# EAGLE design opamp-tester-mk-1.0.0 (EAGLE 9.2.2)
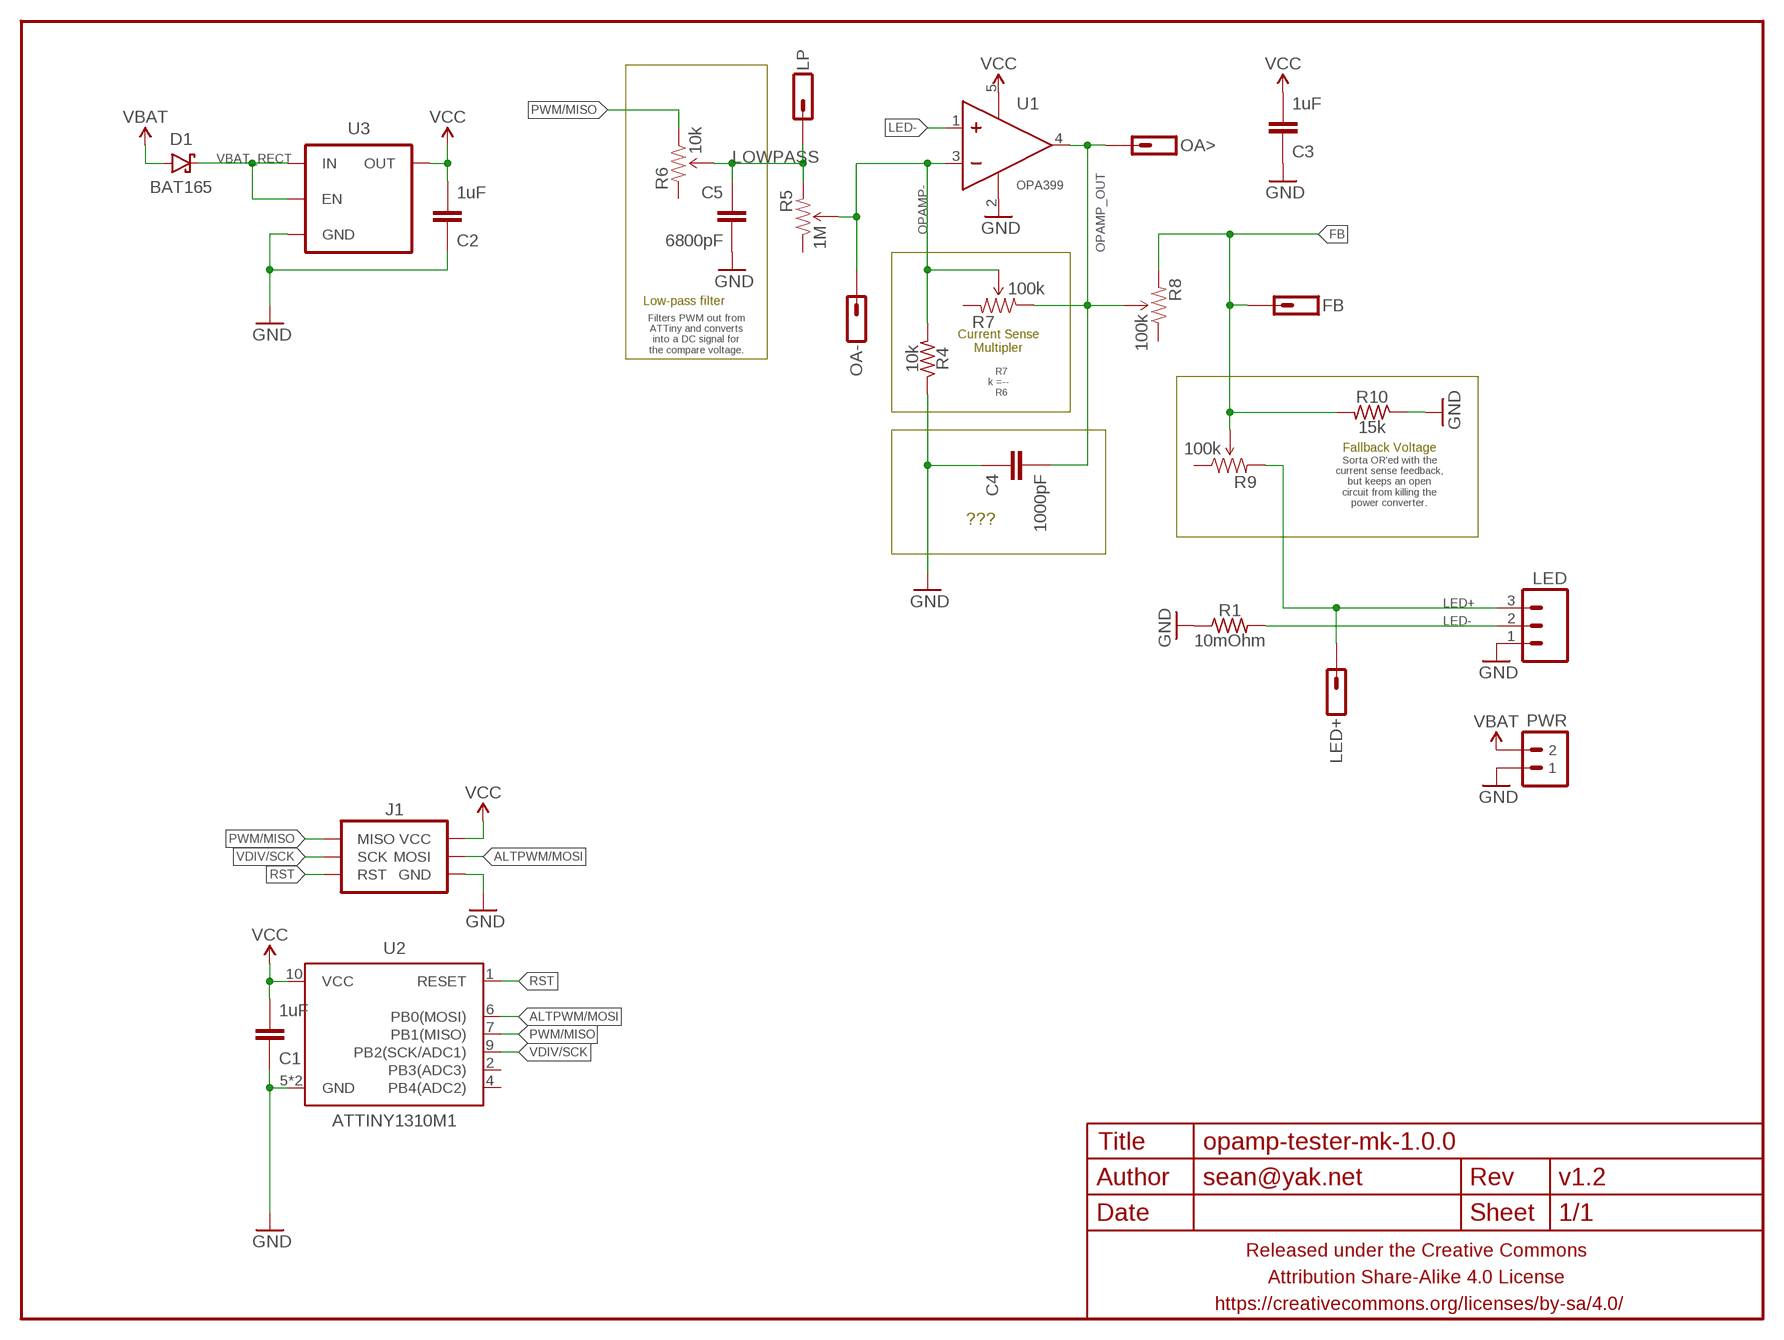
[diagram p0: schematic, sheet 1]

## Parts
C1  1uF  CAPACITOR-CERAMICC0402  [C0402]
C2  1uF  CAPACITOR-CERAMICC0402  [C0402]
C3  1uF  CAPACITOR-CERAMICC0402  [C0402]
C4  1000pF  CAPACITOR-CERAMICC0402  [C0402]
C5  6800pF  CAPACITOR-CERAMICC0402  [C0402]
D1  BAT165  DIODE-SCHOTTKYSOD323  [SOD323-SCHOTTKY]
FB  M01PTH-0.7MM-CIR  [1X01-0.7MM-CIR]
FRAME1  FRAME-LETTERNO_PACKAGE  [DUMMY]
J1  AVR_SPI_PRG_6SMD_TEST_POINTS  [2X3_SMD_TEST_POINTS]
LED  M03SCREW  [SCREWTERMINAL-3.5MM-3]
LED+  M01PTH-0.7MM-CIR  [1X01-0.7MM-CIR]
LP  M01PTH-0.7MM-CIR  [1X01-0.7MM-CIR]
OA-  M01PTH-0.7MM-CIR  [1X01-0.7MM-CIR]
OA>  M01PTH-0.7MM-CIR  [1X01-0.7MM-CIR]
PWR  M02PTH-2MM  [1X02-2MM-PTH]
R1  10mOhm  RESISTORR1206  [R1206]
R4  10k  RESISTORR0402  [R0402]
R5  1M  TRIMPOTEVM3Y-LESS  [EVM3Y-LESS]
R6  10k  TRIMPOTEVM3Y-LESS  [EVM3Y-LESS]
R7  100k  TRIMPOTEVM3Y-LESS  [EVM3Y-LESS]
R8  100k  TRIMPOTEVM3Y-LESS  [EVM3Y-LESS]
R9  100k  TRIMPOTEVM3Y-LESS  [EVM3Y-LESS]
R10  15k  RESISTORR0402  [R0402]
U1  OPA399  OPAMPOPA333-SC-70  [SC70]
U2  ATTINY1310M1  [QFN10(2X5)]
U3  V_REG_ENTLV700  [SC70]

## Nets
ALTPWM/MOSI: J1.4(MOSI) U2.6(PB0(MOSI))
FB: FB.P$1 R8.E(CW) R9.S(WIPER) R10.2
GND: C1.1 C2.1 C3.1 C4.1 C5.2 J1.6(GND) LED.1 PWR.P$1 R1.1 R4.1 R10.1 U1.2(V-) U2.5(GND) U2.PAD(GND) U3.2(GND)
LED+: LED+.P$1 LED.3 R9.E(CW)
LED-: LED.2 R1.2 U1.1(IN+)
LOWPASS: C5.1 LP.P$1 R5.E(CW) R6.S(WIPER)
OPAMP-: OA-.P$1 R4.2 R5.S(WIPER) R7.S(WIPER) U1.3(IN-)
OPAMP_OUT: C4.2 OA>.P$1 R7.A(CCW) R8.S(WIPER) U1.4(OUT)
PWM/MISO: J1.1(MISO) R6.A(CCW) U2.7(PB1(MISO))
RST: J1.5(RST) U2.1(RESET)
VBAT: D1.A PWR.P$2
VBAT_RECT: D1.C U3.1(IN) U3.3(EN)
VCC: C1.2 C2.2 C3.2 J1.2(VCC) U1.5(V+) U2.10(VCC) U3.5(OUT)
VDIV/SCK: J1.3(SCK) U2.9(PB2(SCK/ADC1))
Unconnected: R5.A(CCW) R6.E(CW) R7.E(CW) R8.A(CCW) R9.A(CCW) U2.2(PB3(ADC3)) U2.4(PB4(ADC2))

## Notes on the sheet
- Low-pass filter
- Filters PWM out from
  ATTiny and converts
  into a DC signal for
  the compare voltage.
- Current Sense
  Multipler
- R7
  k =--
    R6
- Fallback Voltage
- Sorta OR'ed with the
  current sense feedback,
  but keeps an open
  circuit from killing the
  power converter.
- ???

## Library data of the parts
C1-C5 = a_parts:CAPACITOR-CERAMIC: CAPACITOR, European symbol
D1 = a_parts:DIODE-SCHOTTKY: Schottky diodes in SFE's production catalog BAT20J 1A 23V 0.62Vf RB751 120mA 40V 0.37Vf PMEG4005EJ 0.5A 40V 0.42Vf MBRA140 1A 40V 0.5Vf B340A 3A 40V SMA
FB LED+ LP OA- OA> = a_parts:M01: Header 1 Standard 1-pin 0.1" header. Use with straight break away headers (SKU : PRT-00116), right angle break away headers (PRT-00553), swiss pins (PRT-00743), machine pins (PRT-00117), and female headers (PRT-00115).
FRAME1 = a_parts:FRAME-LETTER: Schematic Frame Standard 8.5x11 US Letter frame; DESIGNER: sean@yak.net; VERSION: v1.2
J1 = a_parts:AVR_SPI_PRG_6: AVR ISP 6 Pin This is the reduced ISP connector for AVR programming. Common on Arduino. This footprint will take up less PCB space and can be used with a 10-pin to 6-pin adapter such as SKU: BOB-08508 **Special note about "TEST_POINT" package. The stop mask is on the top side, so if you want your programming test points to be on the bottom of your board, make sure to place this package on the bottom side of the board. This also ensure that the orientation to program from the bottom side will be correct.
LED = a_parts:M03: Header 3 Standard 3-pin 0.1" header. Use with straight break away headers (SKU : PRT-00116), right angle break away headers (PRT-00553), swiss pins (PRT-00743), machine pins (PRT-00117), and female headers (PRT-00115). Molex polarized connector foot print use with SKU : PRT-08232 with associated crimp pins and housings.
PWR = a_parts:M02: Standard 2-pin 0.1" header. Use with - straight break away headers ( PRT-00116) - right angle break away headers (PRT-00553) - swiss pins (PRT-00743) - machine pins (PRT-00117) - female headers (PRT-00115) Molex polarized connector foot print use with: PRT-08233 with associated crimp pins and housings. 2.54_SCREWTERM for use with PRT-10571. 3.5mm Screw Terminal footprints for PRT-08084 5mm Screw Terminal footprints for use with PRT-08433
R1 R4 R10 = a_parts:RESISTOR: RESISTOR, American symbol
R5-R9 = a_parts:TRIMPOT: Various small potentiometers for "set-and-forget" applications
U1 = a_parts:OPAMP
U2 = a_parts:ATTINY13: Atmel 8-pin 1kB flash uC
U3 = a_parts:V_REG_EN

## Board
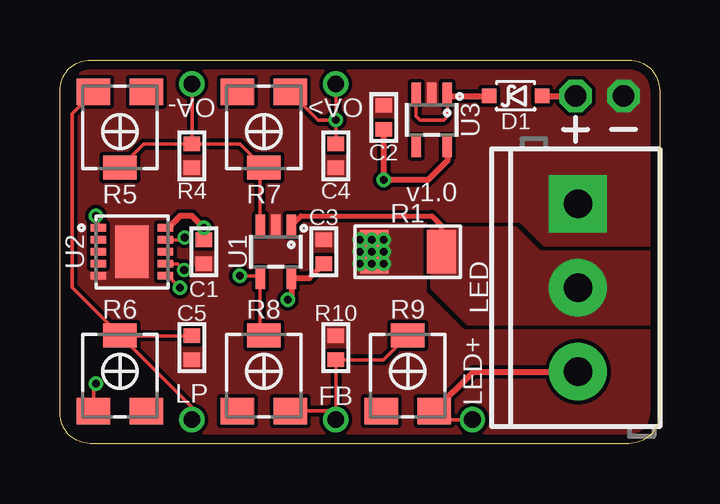
[diagram p1: board, top side]
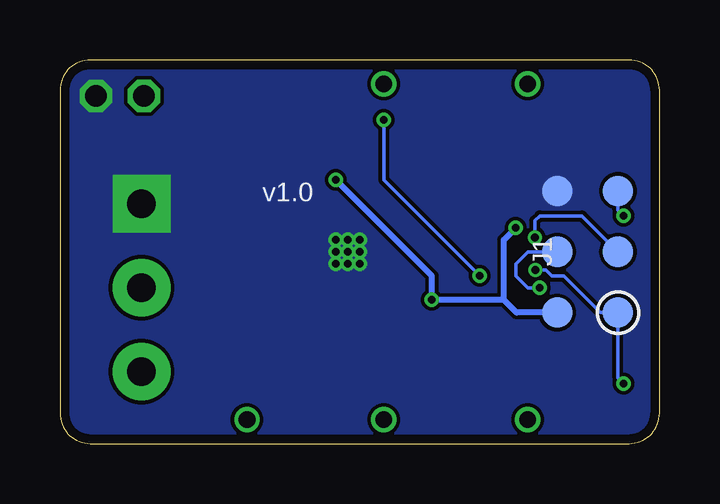
[diagram p2: board, bottom side, seen from below]

Size 25 x 16 mm. Coordinates in mm from the lower left corner, seen from the top.
Outline: 25,14.73 25,1.27 arc-90 23.73,0 1.27,0 arc-90 0,1.27 0,14.73 arc-90 1.27,16 23.73,16 arc-90 25,14.73
Copper layers (1*16): Top 0.035559375mm / dielectric 1.6mm / Bottom 0.035559375mm
Design rules "oshpark-2layer": minimum track width 6mil, minimum drill 10mil, track to track 6mil, track to pad 6mil, pad to pad 6mil, via to via 6mil, smd to smd 0mil, copper to edge 15mil, drill to drill 6mil, minimum pad ring 5mil, minimum via ring 5mil, stop-mask expansion 2.5mil, vias tented up to drill 20mil, thermal gap 10mil

### Footprints (pad centres in the part's own frame; a part is rotated, then mirrored left to right if it is on the bottom)
C0402 = smd 0.6 x 0.7: 1 -0.5,0; 2 0.5,0
SOD323-SCHOTTKY = smd 0.6 x 0.6: A -1.1,0; C 1.1,0
1X01-0.7MM-CIR = drill 0.7: P$1 0,0
2X3_SMD_TEST_POINTS = smd 1.27 x 1.27: 1 -2.54,-1.27; 2 -2.54,1.27; 3 0,-1.27; 4 0,1.27; 5 2.54,-1.27; 6 2.54,1.27
SCREWTERMINAL-3.5MM-3 = drill 1.2 pad 2.413 square: 1 0,0 | drill 1.2 pad 2.413: 2 3.5,0; 3 7,0
1X02-2MM-PTH = drill 0.9 octagon: P$1 -1,0; P$2 1,0
R1206 = smd 1.2 x 1.8: 1 -1.4,0; 2 1.4,0
R0402 = smd 0.6 x 0.7: 1 -0.5,0; 2 0.5,0
EVM3Y-LESS = smd 1.4 x 1.1: A -1.1,-1.65; E 1.1,-1.65 | smd 1.4 x 1: S 0,1.5
SC70 = smd 0.4 x 0.9: 1 -0.65,-1.1; 2 0,-1.1; 3 0.65,-1.1; 4 0.65,1.1; 5 -0.65,1.1
QFN10(2X5) = smd 0.65 x 0.3: 1 -1.4,1; 2 -1.4,0.5; 3 -1.4,0; 4 -1.4,-0.5; 5 -1.4,-1; 6 1.4,-1; 7 1.4,-0.5; 8 1.4,0; 9 1.4,0.5; 10 1.4,1 | smd 1.4 x 2.2: PAD 0,0

### Placement (x,y rotation side)
C1  6,8 90 top
C2  13.5,13.6 270 top
C3  11,8 270 top
C4  11.5,12 90 top
C5  5.5,4 270 top
D1  19,14.5 180 top
FB  11.5,1 0 top
FRAME1  0,0 270 top
J1  3,8 90 bottom
LED  21.6,10 270 top
LED+  17.2,1 0 top
LP  5.5,1 0 top
OA-  5.5,15 0 top
OA>  11.5,15 0 top
PWR  22.5,14.5 180 top
R1  14.5,8 0 top
R4  5.5,12 90 top
R5  2.5,13.01 180 top
R6  2.5,3.01 0 top
R7  8.5,13.01 180 top
R8  8.5,3.01 0 top
R9  14.5,3.01 0 top
R10  11.5,4 270 top
U1  9,8 180 top
U2  3,8 0 top
U3  15.5,13.5 180 top

### Tracks (layer width: path | path; a pad name or v marks a point on that pad's centre or on a via)
ALTPWM/MOSI  (via drill 0.33)
  Top 0.152: U2.6 4.5,7 v5,6.5
  Bottom 0.152: J1.4 5.5,8 6,7.5 6,7 5.5,6.5 v5,6.5
FB
  Top 0.152: R8.E 11.14,1.36 FB.P$1 R10.2 13.49,3.5 R9.S
GND  (via drill 0.33)
  other vias: 13.5,8 13.5,8.5 13.5,7.5 13,7.5 13,8 13,8.5 12.5,7.5 12.5,8 12.5,8.5
  pour Top (rank 6, no thermals): 0,16 0,0 25,0 25,16
  pour Bottom (rank 6, no thermals): 0,0 0,16 25,16 25,0
LED+
  Top 0.152: LED+.P$1 15.96,1 R9.E
  Top 0.25: R9.E 17.24,3 LED.3
LED-
  Top 0.2: U1.1 10.05,9.5 15.5,9.5 15.9,9.1 R1.2
  pour Top (rank 4, no thermals): 15.5,9 19,9 20,8 25,8 25,5 17,5 15.5,6.5
LOWPASS
  Top 0.152: R6.S 0.5,6.51 0.5,13.76 R5.E | R6.S 5.5,1.51 LP.P$1 | C5.1 R6.S
OPAMP-
  Top 0.152: U1.3 8.35,11.36 R7.S 7.51,12.5 R4.2 | R5.S 3.49,12.5 R4.2 | OA-.P$1 R4.2
OPAMP_OUT  (via drill 0.33)
  Top 0.152: R8.S 8.35,4.66 U1.4 8.25,7 v7.5,7 | v11.5,13.5 C4.2 | OA>.P$1 v11.5,13.5 | R7.A 10.76,13.5 v11.5,13.5
  Bottom 0.152: v7.5,7 11.5,11 v11.5,13.5
PWM/MISO  (via drill 0.33)
  Top 0.152: U2.7 4.91,7.5 v5.17,7.24 | R6.A 1.4,2.4 v1.5,2.5
  Bottom 0.152: v5.17,7.24 4.74,7.24 4.5,7 4,7 2.46,5.46 J1.1 1.73,2.73 v1.5,2.5
RST  (via drill 0.33)
  Top 0.152: U2.1 1.6,9.4 v1.5,9.5
  Bottom 0.152: v1.5,9.5 1.73,9.73 J1.5
VBAT
  Top 0.25: D1.A PWR.P$2
VBAT_RECT
  Top 0.152: U3.3 14.85,13.65 15,13.5 16,13.5 16.15,13.65 U3.1
  Top 0.25: U3.1 16.25,14.5 D1.C
VCC  (via drill 0.33)
  Top 0.25: C1.2 v6,9 5.5,9.5 5,9.5 4.5,9 U2.10 | v9.5,6 9.65,6.15 U1.5 10.4,6.9 C3.2 | U3.5 16.15,11.8 15.35,11 v13.5,11 C2.2
  Bottom 0.25: J1.2 5.96,5.46 6.5,6 | 6.5,6 6.5,8.5 v6,9 | 6.5,6 v9.5,6 9.5,7 v13.5,11
VDIV/SCK  (via drill 0.33)
  Top 0.152: U2.9 5.1,8.5 v5.2,8.6
  Bottom 0.152: v5.2,8.6 5.2,9.3 5,9.5 3.23,9.5 J1.3